# EAGLE design ext64K (EAGLE 9.6.2)
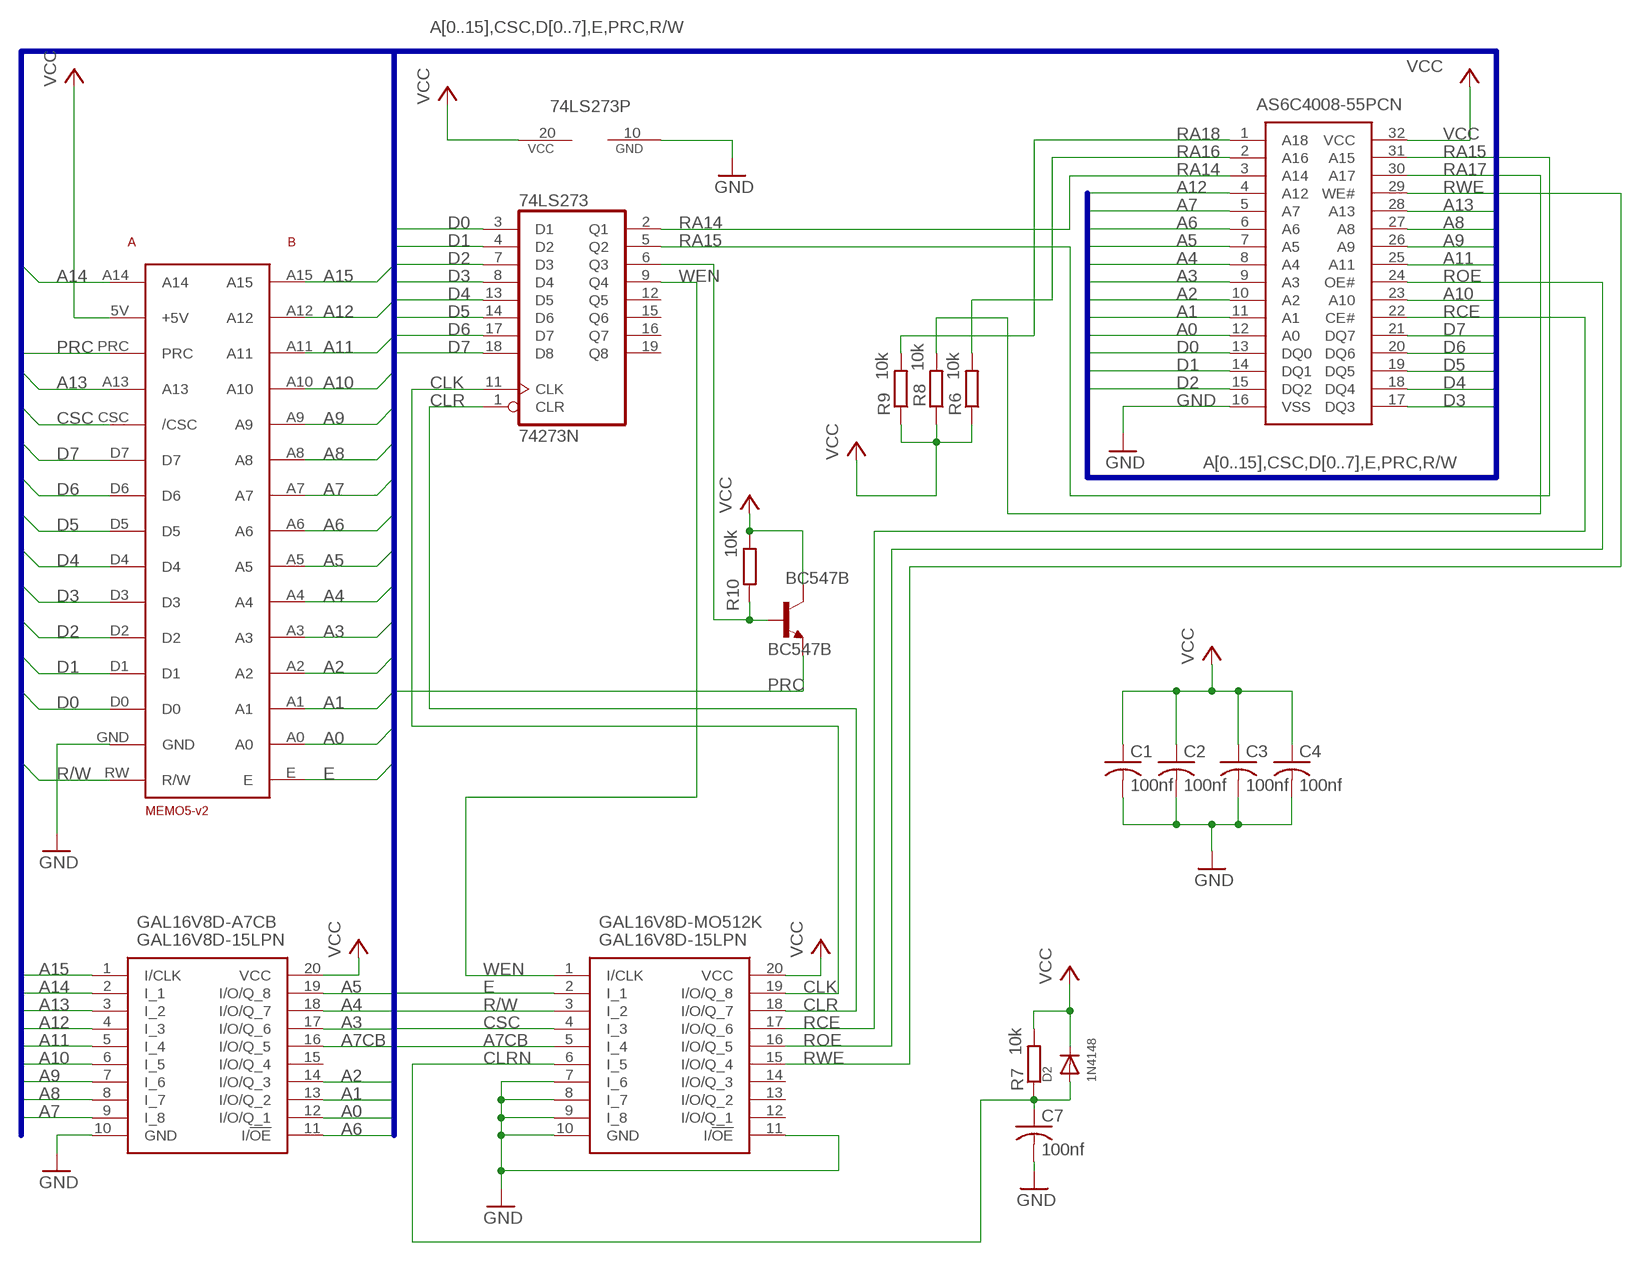
[diagram p0: schematic, sheet 1]

## Parts
74LS273  74273N  [DIL20]
AS6C4008-55PCN  AS6C4008-55PCN  [DIP1524W58P254L4191H406Q32N]
BC547B  BC547B  [TO92]
C1  100nf  C-USC1206  [C1206]
C2  100nf  C-USC1206  [C1206]
C3  100nf  C-USC1206  [C1206]
C4  100nf  C-USC1206  [C1206]
C7  100nf  C-USC1206  [C1206]
D2  1N4148  DIODEDO-1N4148  [DO-1N4148]
GAL16V8D-A7CB  GAL16V8D-15LPN  [DIP762W56P254L2591H533Q20N]
GAL16V8D-MO512K  GAL16V8D-15LPN  [DIP762W56P254L2591H533Q20N]
R6  10k  R-EU_R1206  [R1206]
R7  10k  R-EU_R1206  [R1206]
R8  10k  R-EU_R1206  [R1206]
R9  10k  R-EU_R1206  [R1206]
R10  10k  R-EU_R1206  [R1206]
U$1  MEMO5-V2BRD  [MEMO5-BOARD]

## Nets
A0: AS6C4008-55PCN.12(A0) GAL16V8D-A7CB.12(I/O/Q_1) U$1.A0
A1: AS6C4008-55PCN.11(A1) GAL16V8D-A7CB.13(I/O/Q_2) U$1.A1
A2: AS6C4008-55PCN.10(A2) GAL16V8D-A7CB.14(I/O/Q_3) U$1.A2
A3: AS6C4008-55PCN.9(A3) GAL16V8D-A7CB.17(I/O/Q_6) U$1.A3
A4: AS6C4008-55PCN.8(A4) GAL16V8D-A7CB.18(I/O/Q_7) U$1.A4
A5: AS6C4008-55PCN.7(A5) GAL16V8D-A7CB.19(I/O/Q_8) U$1.A5
A6: AS6C4008-55PCN.6(A6) GAL16V8D-A7CB.11(I/!OE) U$1.A6
A7: AS6C4008-55PCN.5(A7) GAL16V8D-A7CB.9(I_8) U$1.A7
A7CB: GAL16V8D-A7CB.16(I/O/Q_5) GAL16V8D-MO512K.5(I_4)
A8: AS6C4008-55PCN.27(A8) GAL16V8D-A7CB.8(I_7) U$1.A8
A9: AS6C4008-55PCN.26(A9) GAL16V8D-A7CB.7(I_6) U$1.A9
A10: AS6C4008-55PCN.23(A10) GAL16V8D-A7CB.6(I_5) U$1.A10
A11: AS6C4008-55PCN.25(A11) GAL16V8D-A7CB.5(I_4) U$1.A11
A12: AS6C4008-55PCN.4(A12) GAL16V8D-A7CB.4(I_3) U$1.A12
A13: AS6C4008-55PCN.28(A13) GAL16V8D-A7CB.3(I_2) U$1.A13
A14: GAL16V8D-A7CB.2(I_1) U$1.A14
A15: GAL16V8D-A7CB.1(I/CLK) U$1.A15
CLK: 74LS273.11(CLK) GAL16V8D-MO512K.19(I/O/Q_8)
CLR: 74LS273.1(CLR) GAL16V8D-MO512K.18(I/O/Q_7)
CLRN: C7.1 D2.A GAL16V8D-MO512K.6(I_5) R7.1
CSC: GAL16V8D-MO512K.4(I_3) U$1.CSC(/CSC)
D0: 74LS273.3(D1) AS6C4008-55PCN.13(DQ0) U$1.D0
D1: 74LS273.4(D2) AS6C4008-55PCN.14(DQ1) U$1.D1
D2: 74LS273.7(D3) AS6C4008-55PCN.15(DQ2) U$1.D2
D3: 74LS273.8(D4) AS6C4008-55PCN.17(DQ3) U$1.D3
D4: 74LS273.13(D5) AS6C4008-55PCN.18(DQ4) U$1.D4
D5: 74LS273.14(D6) AS6C4008-55PCN.19(DQ5) U$1.D5
D6: 74LS273.17(D7) AS6C4008-55PCN.20(DQ6) U$1.D6
D7: 74LS273.18(D8) AS6C4008-55PCN.21(DQ7) U$1.D7
E: GAL16V8D-MO512K.2(I_1) U$1.E
GND [pwr]: 74LS273.10(GND) AS6C4008-55PCN.16(VSS) C1.2 C2.2 C3.2 C4.2 C7.2 GAL16V8D-A7CB.10(GND) GAL16V8D-MO512K.7(I_6) GAL16V8D-MO512K.8(I_7) GAL16V8D-MO512K.9(I_8) GAL16V8D-MO512K.10(GND) GAL16V8D-MO512K.11(I/!OE) U$1.GND
N$1: 74LS273.6(Q3) BC547B.2(B) R10.1
PRC: BC547B.1(E) U$1.PRC
R/W: GAL16V8D-MO512K.3(I_2) U$1.RW(R/W)
RA14: 74LS273.2(Q1) AS6C4008-55PCN.3(A14)
RA15: 74LS273.5(Q2) AS6C4008-55PCN.31(A15)
RA16: AS6C4008-55PCN.2(A16) R6.2
RA17: AS6C4008-55PCN.30(A17) R8.2
RA18: AS6C4008-55PCN.1(A18) R9.2
RCE: AS6C4008-55PCN.22(CE#) GAL16V8D-MO512K.17(I/O/Q_6)
ROE: AS6C4008-55PCN.24(OE#) GAL16V8D-MO512K.16(I/O/Q_5)
RWE: AS6C4008-55PCN.29(WE#) GAL16V8D-MO512K.15(I/O/Q_4)
VCC [pwr]: 74LS273.20(VCC) AS6C4008-55PCN.32(VCC) BC547B.3(C) C1.1 C2.1 C3.1 C4.1 D2.C GAL16V8D-A7CB.20(VCC) GAL16V8D-MO512K.20(VCC) R6.1 R7.2 R8.1 R9.1 R10.2 U$1.5V(+5V)
WEN: 74LS273.9(Q4) GAL16V8D-MO512K.1(I/CLK)
Unconnected: 74LS273.12(Q5) 74LS273.15(Q6) 74LS273.16(Q7) 74LS273.19(Q8) GAL16V8D-A7CB.15(I/O/Q_4) GAL16V8D-MO512K.12(I/O/Q_1) GAL16V8D-MO512K.13(I/O/Q_2) GAL16V8D-MO512K.14(I/O/Q_3)

## Buses
A[0..15],CSC,D[0..7],E,PRC,R/W

## Library data of the parts
74LS273 = 74xx-us:74*273: Octal D type FLIP FLOP, clear
AS6C4008-55PCN = SamacSys_Parts:AS6C4008-55PCN: CMOS SRAM Source: Datasheet <http://componentsearchengine.com/Datasheets/1/AS6C4008-55PCN.pdf>; DESCRIPTION: CMOS SRAM; HEIGHT: 4.064mm; MANUFACTURER_NAME: Alliance Memory; MANUFACTURER_PART_NUMBER: AS6C4008-55PCN; MOUSER_PART_NUMBER: 913-AS6C4008-55PCN; MOUSER_PRICE-STOCK: https://www.mouser.co.uk/ProductDetail/Alliance-Memory/AS6C4008-55PCN?qs=E5c5%252Bmu3i3%252BMOyro1Tlhzg%3D%3D
BC547B = transistor-npn:BC547*: NPN Transistor
C1-C4 C7 = resistor:C-US: CAPACITOR, American symbol
D2 = adafruit:DIODE: Diode SMADIODE - SMA Surface Mount Package 20V 1A Schottky Diode Digikey: 641-1014-6-ND DO-1N4148 - Through Hole Small Current Diode SOD-123 20V 1 A (.5mV Vf) Schottky Diode - Digikey: MBRX120TPMSCT-ND SOD-323 10V 570mA (.38mV Vf, 3ns) Schottky Diode - Digikey: ZLLS410CT-ND SOD-523 30V 30mA Schottky Diode (RB751S-40TE61) - Digikey: RB751S-40TE61CT-ND SOT23-R/W - SOT23 Package (R = Solder Paste/Reflow Ovens, W = Hand-Soldering) BAT54Film 40V 300mA - Digikey: 497-7162-1-ND
GAL16V8D-A7CB GAL16V8D-MO512K = SamacSys_Parts:GAL16V8D-15LPN: IC CPLD 8MC 15NS 20DIP Source: Datasheet <http://uk.rs-online.com/web/p/products/6250071>; DESCRIPTION: IC CPLD 8MC 15NS 20DIP; HEIGHT: 5.334mm; MANUFACTURER_NAME: Lattice Semiconductor; MANUFACTURER_PART_NUMBER: GAL16V8D-15LPN; MOUSER_PART_NUMBER: 842-GAL16V8D15LPN; MOUSER_PRICE-STOCK: https://www.mouser.co.uk/ProductDetail/Lattice/GAL16V8D-15LPN/?qs=SKRcP3y%252BHgMoZwlrwJ0h8g%3D%3D
R6-R10 = resistor:R-EU_: RESISTOR, European symbol
U$1 = custom-chips:MEMO5-V2

## Net classes
0 default: width 0.152 mm, drill 0.152 mm, clearance 0.152 mm
1 pwr: width 0.305 mm, drill 0.305 mm, clearance 0.305 mm

## Board
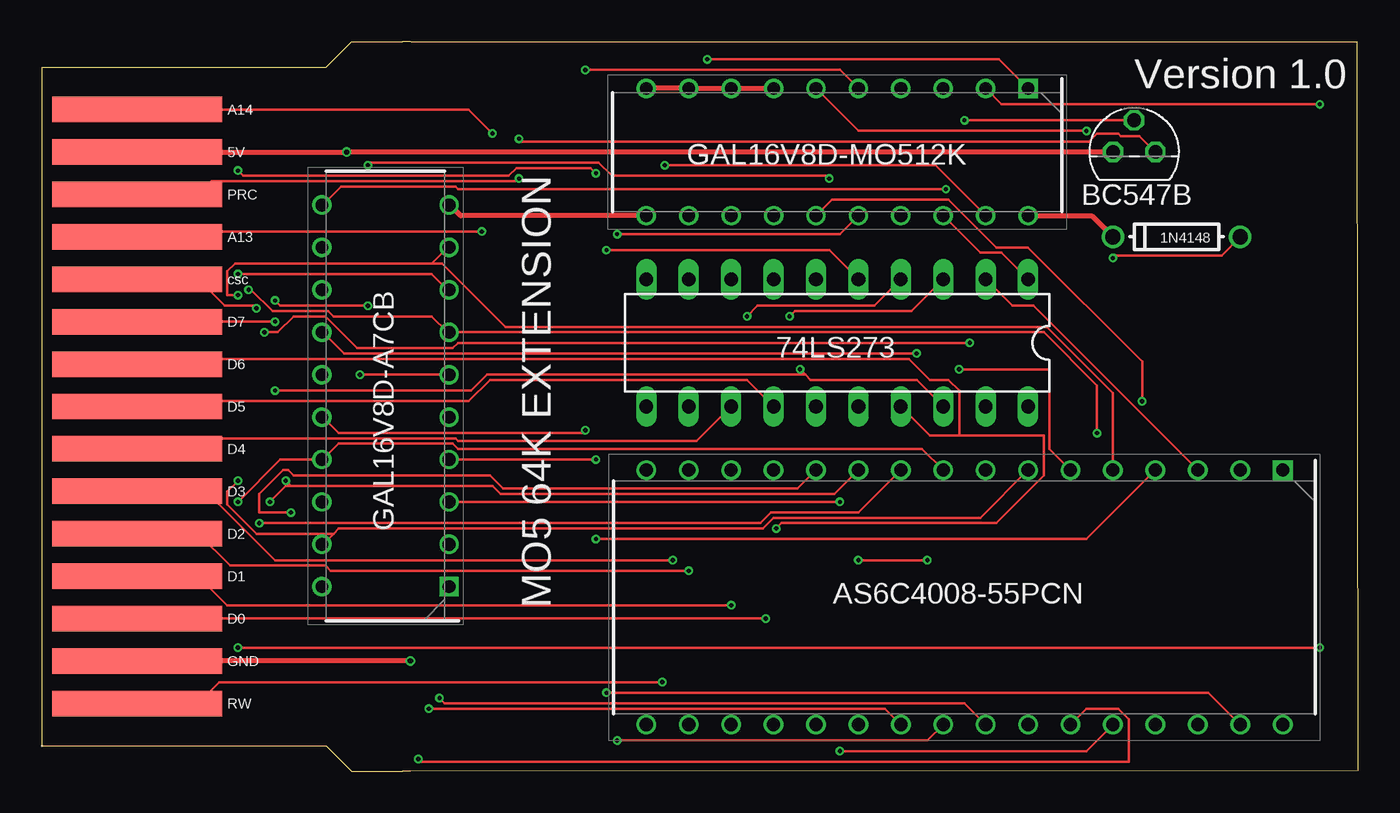
[diagram p1: board, top side]
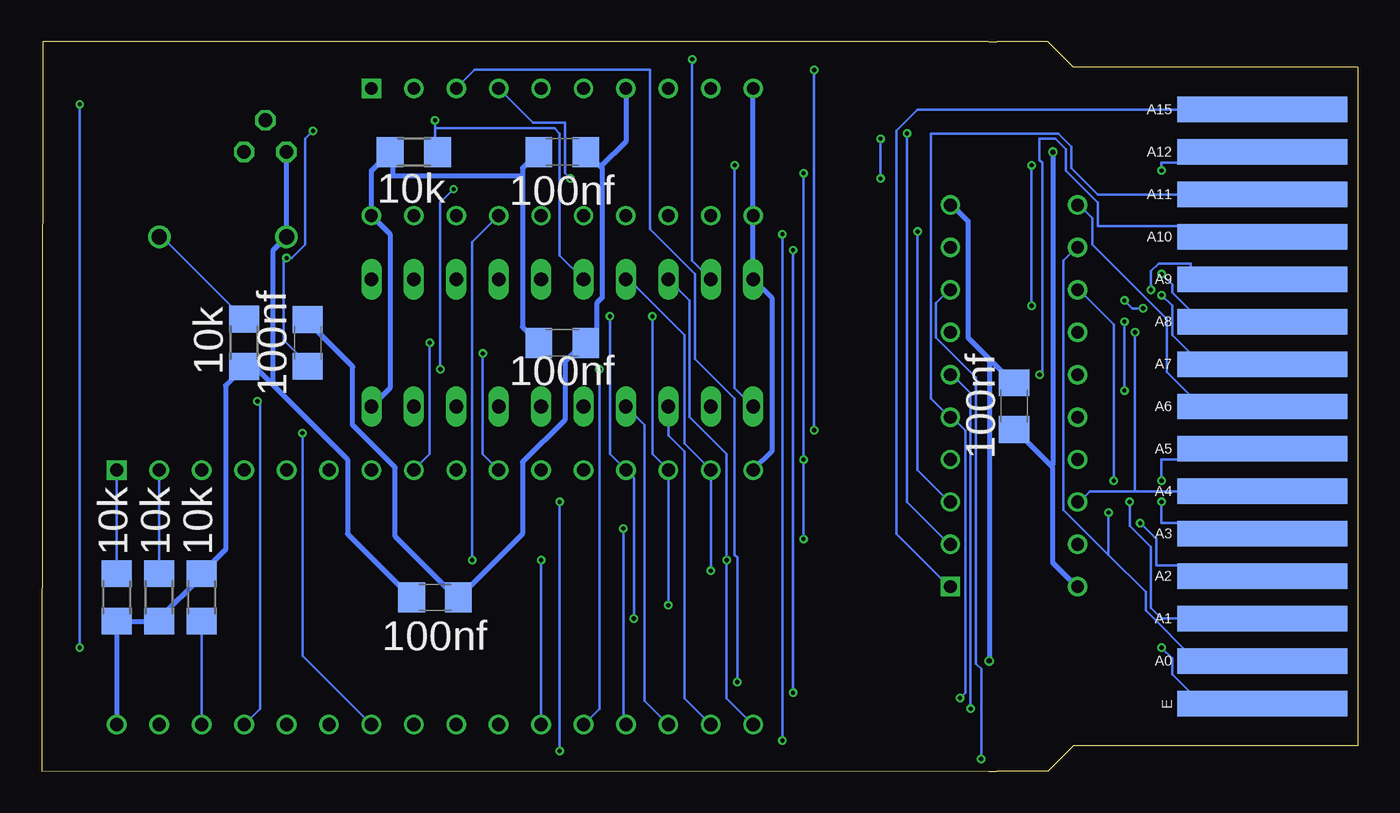
[diagram p2: board, bottom side, seen from below]

Size 78.79 x 43.69 mm. Coordinates in mm from the lower left corner, seen from the top.
Outline: 22.12,43.69 78.74,43.69 78.79,0.03 22.1,0 21.59,0
Outline: 22.1,43.69 21.59,43.69
Copper layers (1*16): Top 0.035559375mm / dielectric 1.6mm / Bottom 0.035559375mm
Design rules "oshpark-2layer": minimum track width 6mil, minimum drill 10mil, track to track 6mil, track to pad 6mil, pad to pad 6mil, via to via 6mil, smd to smd 6mil, copper to edge 15mil, drill to drill 6mil, minimum pad ring 5mil, minimum via ring 5mil, stop-mask expansion 2.5mil, vias tented up to drill 0mil, thermal gap 10mil
vRestrict: area 9.5,1.5 to 11.4,42.2; area 15.2,9.8 to 18.4,35.2; area 22.9,9.8 to 26,35.2; area 34.9,39.6 to 60.3,42.2; area 35.6,32 to 60.3,34.5; area 34.9,27.6 to 60.3,31.4; area 34.9,19.9 to 60.3,23.7; area 34.9,16.8 to 75.6,19.9; area 34.9,1.5 to 75.6,4.1; area 67.3,6.6 to 76.2,13.6; area 52.1,8.5 to 58.4,12.3; area 61.6,22.5 to 68.6,28.8; area 68.6,21.2 to 74.9,30.1; area 62.9,35.2 to 67.9,40.9

### Footprints (pad centres in the part's own frame; a part is rotated, then mirrored left to right if it is on the bottom)
DIL20 = drill 0.813 long: 1 -11.43,-3.81; 2 -8.89,-3.81; 3 -6.35,-3.81; 4 -3.81,-3.81; 5 -1.27,-3.81; 6 1.27,-3.81; 7 3.81,-3.81; 8 6.35,-3.81; 9 8.89,-3.81; 10 11.43,-3.81; 11 11.43,3.81; 12 8.89,3.81; 13 6.35,3.81; 14 3.81,3.81; 15 1.27,3.81; 16 -1.27,3.81; 17 -3.81,3.81; 18 -6.35,3.81; 19 -8.89,3.81; 20 -11.43,3.81
DIP1524W58P254L4191H406Q32N = drill 0.784 pad 1.184 square: 1 -7.62,19.05 | drill 0.784 pad 1.184: 2 -7.62,16.51; 3 -7.62,13.97; 4 -7.62,11.43; 5 -7.62,8.89; 6 -7.62,6.35; 7 -7.62,3.81; 8 -7.62,1.27; 9 -7.62,-1.27; 10 -7.62,-3.81; 11 -7.62,-6.35; 12 -7.62,-8.89; 13 -7.62,-11.43; 14 -7.62,-13.97; 15 -7.62,-16.51; 16 -7.62,-19.05; 17 7.62,-19.05; 18 7.62,-16.51; 19 7.62,-13.97; 20 7.62,-11.43; 21 7.62,-8.89; 22 7.62,-6.35; 23 7.62,-3.81; 24 7.62,-1.27; 25 7.62,1.27; 26 7.62,3.81; 27 7.62,6.35; 28 7.62,8.89; 29 7.62,11.43; 30 7.62,13.97; 31 7.62,16.51; 32 7.62,19.05
TO92 = drill 0.813 octagon: 1 1.27,0; 2 0,1.905; 3 -1.27,0
C1206 = smd 1.6 x 1.8: 1 -1.4,0; 2 1.4,0
DO-1N4148 = drill 0.9: A -3.81,0; C 3.81,0
DIP762W56P254L2591H533Q20N = drill 0.759 pad 1.159 square: 1 -3.81,11.43 | drill 0.759 pad 1.159: 2 -3.81,8.89; 3 -3.81,6.35; 4 -3.81,3.81; 5 -3.81,1.27; 6 -3.81,-1.27; 7 -3.81,-3.81; 8 -3.81,-6.35; 9 -3.81,-8.89; 10 -3.81,-11.43; 11 3.81,-11.43; 12 3.81,-8.89; 13 3.81,-6.35; 14 3.81,-3.81; 15 3.81,-1.27; 16 3.81,1.27; 17 3.81,3.81; 18 3.81,6.35; 19 3.81,8.89; 20 3.81,11.43
R1206 = smd 1.6 x 1.803: 1 -1.422,0; 2 1.422,0
MEMO5-BOARD = smd 1.524 x 10.16: 5V -12.7,5.715; A13 -7.62,5.715; A14 -15.24,5.715; CSC -5.08,5.715; D0 15.24,5.715; D1 12.7,5.715; D2 10.16,5.715; D3 7.62,5.715; D4 5.08,5.715; D5 2.54,5.715; D6 0,5.715; D7 -2.54,5.715; GND 17.78,5.715; PRC -10.16,5.715; RW 20.32,5.715 | smd 1.524 x 10.16 bottom: A0 17.78,5.715; A1 15.24,5.715; A2 12.7,5.715; A3 10.16,5.715; A4 7.62,5.715; A5 5.08,5.715; A6 2.54,5.715; A7 0,5.715; A8 -2.54,5.715; A9 -5.08,5.715; A10 -7.62,5.715; A11 -10.16,5.715; A12 -12.7,5.715; A15 -15.24,5.715; E 20.32,5.715

### Placement (x,y rotation side)
74LS273  47.62,25.65 180 top
AS6C4008-55PCN  55.24,10.41 270 top
BC547B  65.41,37.08 0 top
C1  47.62,37.08 0 bottom
C2  55.24,10.41 0 bottom
C3  20.57,21.87 90 bottom
C4  47.62,25.65 0 bottom
C7  62.87,25.65 90 bottom
D2  67.94,32 180 top
GAL16V8D-A7CB  20.57,22.48 180 top
GAL16V8D-MO512K  47.62,37.08 270 top
R6  71.75,10.41 90 bottom
R7  66.67,25.65 270 bottom
R8  69.22,10.41 270 bottom
R9  74.3,10.41 90 bottom
R10  56.52,37.08 180 bottom
U$1  0,24.38 270 top

### Tracks (layer width: path | path; a pad name or v marks a point on that pad's centre or on a via)
A0  (via drill 0.25)
  Top 0.152: AS6C4008-55PCN.12 45.24,16.92 27.62,16.92 26.83,17.72 15.08,17.72 14.76,18.03 14.45,18.03 13.02,16.61 13.02,15.49 v14.92,15.49
  Bottom 0.152: 14.92,12.95 12.7,10.73 12.7,9.62 9.68,6.6 U$1.A0 | 14.92,12.95 17.62,15.65 17.62,30.58 16.83,31.37 GAL16V8D-A7CB.12 | 14.92,12.95 v14.92,15.49
A1  (via drill 0.25)
  Top 0.152: 14.92,17.08 v14.61,17.4 | 14.92,17.08 26.99,17.08 27.46,16.61 47.47,16.61 AS6C4008-55PCN.11 | v13.65,16.13 14.61,17.08 14.92,17.08
  Bottom 0.152: v14.61,17.4 14.61,26.77 16.67,28.83 GAL16V8D-A7CB.13 | U$1.A1 11.75,9.14 12.38,9.78 12.38,13.43 13.65,14.7 v13.65,16.13
A2  (via drill 0.25)
  Top 0.152: v52.39,25.02 18.1,25.02 16.83,26.29 GAL16V8D-A7CB.14 | v13.02,14.86 43.02,14.86 43.66,15.49 48.9,15.49 AS6C4008-55PCN.10
  Bottom 0.152: v52.39,25.02 52.39,18.99 AS6C4008-55PCN.10 | U$1.A2 6.35,12.32 12.06,12.32 12.06,13.91 v13.02,14.86
A3  (via drill 0.25)
  Top 0.152: AS6C4008-55PCN.9 52.7,19.3 24.92,19.3 24.61,19.62 17.78,19.62 16.83,18.67 GAL16V8D-A7CB.17 14.29,18.67 v11.75,16.13
  Bottom 0.152: U$1.A3 6.35,14.86 11.75,14.86 v11.75,16.13
A4  (via drill 0.25)
  Top 0.152: v55.56,25.65 24.92,25.65 24.61,25.34 18.89,25.34 16.99,27.24 15.08,27.24 14.13,26.29 v13.34,26.29
  Bottom 0.152: U$1.A4 13.34,16.76 | 13.34,16.76 16.03,16.76 16.67,16.13 GAL16V8D-A7CB.18 | AS6C4008-55PCN.8 55.56,18.99 v55.56,25.65 | 13.34,16.76 v13.34,26.29
A5  (via drill 0.25)
  Top 0.152: 17.46,14.22 17.78,14.54 43.18,14.54 43.81,15.18 56.2,15.18 AS6C4008-55PCN.7 | 17.46,14.22 16.83,13.59 GAL16V8D-A7CB.19 | v11.75,17.4 11.11,16.76 11.11,15.97 12.86,14.22 17.46,14.22
  Bottom 0.152: U$1.A5 6.35,18.67 11.75,18.67 v11.75,17.4
A6  (via drill 0.25)
  Top 0.152: AS6C4008-55PCN.6 60.33,19.3 60.33,24.07 v54.93,24.07 | v54.13,34.86 24.92,34.86 24.77,35.02 17.94,35.02 16.83,33.91 GAL16V8D-A7CB.11
  Bottom 0.152: U$1.A6 9.37,21.84 11.43,23.91 11.43,27.08 15.88,31.53 15.88,33.12 16.67,33.91 GAL16V8D-A7CB.11 | v54.93,24.07 54.93,34.07 v54.13,34.86
A7  (via drill 0.25)
  Top 0.152: 23.34,30.42 24.29,31.37 GAL16V8D-A7CB.9 | 23.34,30.42 11.59,30.42 11.11,29.94 11.11,28.51 v11.75,28.51 | AS6C4008-55PCN.5 64.14,22.64 60.17,26.61 27.78,26.61 23.97,30.42 23.34,30.42
  Bottom 0.152: v11.75,28.51 11.11,27.88 11.11,26.13 9.37,24.38 U$1.A7
A7CB  (via drill 0.25)
  Top 0.152: v32.54,20.42 32.38,20.26 17.78,20.26 16.83,21.21 GAL16V8D-A7CB.16 | v32.54,42.01 47.78,42.01 GAL16V8D-MO512K.5
  Bottom 0.152: v32.54,42.01 v32.54,20.42
A8  (via drill 0.25)
  Top 0.152: v11.75,29.78 23.34,29.78 24.29,28.83 GAL16V8D-A7CB.8 | AS6C4008-55PCN.27 62.55,3.75 64.45,3.75 65.09,3.11 65.09,0.57 22.7,0.57 v22.54,0.73
  Bottom 0.152: v11.75,29.78 11.11,29.15 11.11,28.67 9.37,26.92 U$1.A8 | v22.54,0.73 22.54,6.13 22.86,6.45 22.86,23.59 25.24,25.97 25.24,28.04 24.45,28.83 GAL16V8D-A7CB.8
A9  (via drill 0.25)
  Top 0.152: v12.38,28.83 12.54,28.83 13.81,27.56 17.14,27.56 17.46,27.24 23.34,27.24 24.29,26.29 GAL16V8D-A7CB.7 60.01,26.29 63.18,23.11 v63.18,20.26
  Bottom 0.152: v12.38,28.83 12.38,29.94 11.91,30.42 10,30.42 10,30.1 9.37,29.46 U$1.A9 | AS6C4008-55PCN.26 63.18,6.92 v63.18,20.26
A10  (via drill 0.25)
  Top 0.152: v23.18,3.75 50.48,3.75 AS6C4008-55PCN.23 | GAL16V8D-A7CB.6 v19.05,23.75
  Bottom 0.152: v23.18,3.75 23.18,22.64 24.29,23.75 GAL16V8D-A7CB.6 | U$1.A10 6.35,32.64 15.56,32.64 15.56,34.07 17.46,35.97 17.46,37.24 18.1,37.88 19.05,37.88 19.05,36.61 18.89,36.45 18.89,23.91 v19.05,23.75
A11  (via drill 0.25)
  Top 0.152: v23.81,4.38 24.13,4.06 55.24,4.06 AS6C4008-55PCN.25
  Bottom 0.152: v23.81,4.38 23.5,4.7 23.5,20.42 24.29,21.21 GAL16V8D-A7CB.5 24.45,21.21 25.56,22.32 25.56,38.2 17.94,38.2 17.14,37.4 17.14,36.13 15.56,34.54 U$1.A11
A12  (via drill 0.25)
  Top 0.152: v33.18,18.67 GAL16V8D-A7CB.4 | v33.18,13.91 62.55,13.91 AS6C4008-55PCN.4 | v11.75,35.97 12.06,35.66 27.94,35.66 28.42,36.13 32.86,36.13 v33.18,35.81
  Bottom 0.152: v33.18,13.91 v33.18,18.67 v33.18,35.81 | U$1.A12 6.35,36.45 11.75,36.45 v11.75,35.97
A13  (via drill 0.25)
  Top 0.152: v26.35,32.32 6.03,32.32 U$1.A13 | AS6C4008-55PCN.28 62.55,1.21 v47.78,1.21 | GAL16V8D-A7CB.3 v47.78,16.13
  Bottom 0.152: v26.35,32.32 26.35,18.03 24.45,16.13 GAL16V8D-A7CB.3 | v47.78,16.13 v47.78,1.21
A14  (via drill 0.25)
  Top 0.152: v26.99,38.2 25.56,39.62 U$1.A14
  Bottom 0.152: v26.99,38.2 26.99,16.13 24.45,13.59 GAL16V8D-A7CB.2
A15
  Bottom 0.152: U$1.A15 26.35,39.62 27.62,38.35 27.62,14.22 24.45,11.05 GAL16V8D-A7CB.1
CLK  (via drill 0.25)
  Top 0.152: GAL16V8D-MO512K.19 53.5,36.29 v37.31,36.29
  Bottom 0.152: v37.31,36.29 37.31,22.96 74LS273.11
CLR
  Top 0.152: GAL16V8D-MO512K.18 56.2,31.05 57.47,31.05 74LS273.1
CLRN  (via drill 0.25)
  Top 0.152: v64.14,30.73 64.29,30.89 70.64,30.89 D2.A | GAL16V8D-MO512K.6 48.9,38.35 v62.55,38.35
  Bottom 0.152: C7.1 62.87,24.38 64.29,25.81 64.29,30.58 v64.14,30.73 63.82,30.73 63.02,31.53 63.02,37.88 v62.55,38.35 | D2.A 71.6,32 R7.1
CSC  (via drill 0.25)
  Top 0.152: v47.15,35.5 46.99,35.66 34.13,35.66 33.34,36.45 19.68,36.45 v19.53,36.29 | v19.53,27.88 14.29,27.88 v13.97,28.19 | v12.86,27.72 12.7,27.88 10.95,27.88 9.37,29.46 U$1.CSC
  Bottom 0.152: GAL16V8D-MO512K.4 49.37,38.83 47.47,38.83 47.47,35.81 v47.15,35.5 | v19.53,27.88 v19.53,36.29 | v13.97,28.19 13.49,27.72 v12.86,27.72
D0  (via drill 0.25)
  Top 0.152: v44.77,27.24 45.09,27.56 52.07,27.56 74LS273.3 | U$1.D0 v43.34,9.14
  Bottom 0.152: v44.77,27.24 44.77,18.99 AS6C4008-55PCN.13 43.34,17.56 v43.34,9.14
D1  (via drill 0.25)
  Top 0.152: v42.23,27.24 42.86,27.88 49.85,27.88 74LS273.4 | v41.27,9.94 11.11,9.94 9.37,11.68 U$1.D1
  Bottom 0.152: v42.23,27.24 42.23,18.99 AS6C4008-55PCN.14 v41.27,9.94
D2  (via drill 0.25)
  Top 0.152: v38.73,12 17.3,12 16.99,12.32 11.27,12.32 9.37,14.22 U$1.D2
  Bottom 0.152: 74LS273.7 43.66,29.46 40.32,26.13 40.32,19.62 AS6C4008-55PCN.15 v38.73,12
D3  (via drill 0.25)
  Top 0.152: U$1.D3 6.35,16.13 10.48,16.13 13.97,12.64 v37.78,12.64
  Bottom 0.152: AS6C4008-55PCN.17 37.78,4.38 v37.78,12.64 37.78,18.99 40.01,21.21 40.01,28.19 74LS273.8
D4
  Top 0.152: 74LS273.13 39.21,19.78 24.92,19.78 24.77,19.94 6.35,19.94 U$1.D4
  Bottom 0.152: AS6C4008-55PCN.18 40.32,4.38 40.32,19.15 41.27,20.1 74LS273.13
D5
  Top 0.152: 74LS273.14 42.23,23.43 26.83,23.43 25.56,22.16 6.03,22.16 U$1.D5
  Bottom 0.152: AS6C4008-55PCN.19 42.7,4.22 42.7,20.73 74LS273.14
D6  (via drill 0.25)
  Top 0.152: v43.97,14.54 44.29,14.86 57.15,14.86 60.01,17.72 60.01,20.1 54.93,20.1 | 54.93,20.1 53.18,20.1 74LS273.17 | U$1.D6 6.03,24.7 51.91,24.7 53.18,23.43 54.29,23.43 54.93,22.8 54.93,20.1
  Bottom 0.152: AS6C4008-55PCN.20 43.97,2.95 v43.97,14.54
D7  (via drill 0.25)
  Top 0.152: 45.72,23.75 46.04,23.43 52.39,23.43 74LS273.18 | 45.72,23.75 v45.4,24.07 | v13.97,26.92 U$1.D7 | v13.97,22.8 25.72,22.8 26.67,23.75 45.72,23.75
  Bottom 0.152: AS6C4008-55PCN.21 45.4,3.75 v45.4,24.07 | v13.97,22.8 v13.97,26.92
E  (via drill 0.25)
  Top 0.152: GAL16V8D-MO512K.2 57.47,39.94 v76.52,39.94 | v11.75,7.4 v76.52,7.4
  Bottom 0.152: v76.52,7.4 v76.52,39.94 | v11.75,7.4 11.11,6.76 11.11,5.81 9.37,4.06 U$1.E
GND  (via drill 0.3)
  Top 0.305: GAL16V8D-MO512K.10 GAL16V8D-MO512K.9 GAL16V8D-MO512K.8 GAL16V8D-MO512K.7 | GAL16V8D-MO512K.11 25.08,33.27 24.45,33.91 GAL16V8D-A7CB.10 | v22.07,6.6 U$1.GND
  Bottom 0.305: 45.32,36.21 46.2,37.08 C1.2 | 45.32,36.21 45.24,36.13 45.24,28.35 45.56,28.04 45.56,26.29 46.2,25.65 C4.2 46.35,25.65 47.47,24.54 47.47,21.05 50.01,18.51 50.01,14.22 53.82,10.41 C2.2 53.98,10.41 57.63,14.07 57.63,18.19 60.17,20.73 60.17,24.23 62.87,26.92 C7.2 | 21.99,24.62 23.34,25.97 23.34,32.96 24.29,33.91 GAL16V8D-A7CB.10 | 21.99,24.62 20.64,23.27 C3.2 | AS6C4008-55PCN.16 35.08,19.15 35.08,28.35 74LS273.10 GAL16V8D-MO512K.11 GAL16V8D-MO512K.10 | v22.07,6.6 22.07,24.54 21.99,24.62 | 45.32,36.21 43.81,37.72 GAL16V8D-MO512K.7
N$1  (via drill 0.25)
  Top 0.152: BC547B.2 v55.24,38.99
  Bottom 0.152: v55.24,38.99 55.24,38.51 | 55.24,38.51 55.24,37.08 R10.1 | 74LS273.6 47.78,30.89 47.78,38.2 48.1,38.51 55.24,38.51
PRC  (via drill 0.25)
  Top 0.152: BC547B.1 65.72,38.04 64.61,38.04 64.45,38.2 63.18,38.2 62.71,37.72 28.73,37.72 v28.57,37.88 | v28.57,35.5 28.42,35.34 10.16,35.34 9.37,34.54 U$1.PRC
  Bottom 0.152: v28.57,35.5 v28.57,37.88
R/W  (via drill 0.25)
  Top 0.152: v37.15,5.33 10.64,5.33 9.37,4.06 U$1.RW
  Bottom 0.152: GAL16V8D-MO512K.3 52.86,42.01 42.39,42.01 42.39,32.48 39.69,29.78 39.69,24.7 37.31,22.32 37.31,12.95 37.15,12.8 v37.15,5.33
RA14
  Top 0.152: AS6C4008-55PCN.3 59.37,27.88 58.1,27.88 74LS273.2
RA15  (via drill 0.25)
  Top 0.152: AS6C4008-55PCN.31 69.85,4.7 v33.81,4.7 | v33.81,31.21 47.15,31.21 74LS273.5
  Bottom 0.152: v33.81,31.21 v33.81,4.7
RA16
  Bottom 0.152: AS6C4008-55PCN.2 R6.2
RA17
  Bottom 0.152: AS6C4008-55PCN.30 R8.2
RA18
  Bottom 0.152: AS6C4008-55PCN.1 R9.2
RCE  (via drill 0.25)
  Top 0.152: v48.9,12.64 v53.02,12.64
  Bottom 0.152: GAL16V8D-MO512K.17 53.02,31.69 v53.02,12.64 | AS6C4008-55PCN.22 v48.9,12.64
ROE  (via drill 0.25)
  Top 0.152: GAL16V8D-MO512K.16 47.78,32.16 v34.45,32.16 | v34.45,1.84 53.02,1.84 AS6C4008-55PCN.24
  Bottom 0.152: v34.45,1.84 v34.45,32.16
RWE  (via drill 0.25)
  Top 0.152: GAL16V8D-MO512K.15 47.31,34.23 54.29,34.23 57.15,31.37 59.05,31.37 65.88,24.54 v65.88,22.16
  Bottom 0.152: v65.88,22.16 65.72,22 65.72,3.75 AS6C4008-55PCN.29
VCC  (via drill 0.3)
  Top 0.305: U$1.5V v18.26,37.08 BC547B.3 | D2.C 62.87,33.27 GAL16V8D-MO512K.20
  Bottom 0.305: 18.34,18.27 18.26,18.19 18.26,12.48 16.83,11.05 GAL16V8D-A7CB.20 | 18.34,18.27 20.48,20.42 C3.1 | v18.26,37.08 18.26,18.35 18.34,18.27 | 50.01,35.66 50.01,36.13 49.05,37.08 C1.1 | 50.01,35.66 50.01,26.61 49.05,25.65 C4.1 | BC547B.3 D2.C 64.93,31.21 64.93,23.27 65.01,23.19 | 74LS273.20 57.94,22.96 57.94,32.16 GAL16V8D-MO512K.20 59.05,35.97 R10.2 57.78,37.08 57.78,35.66 50.01,35.66 | R9.1 R6.1 71.75,9.14 69.22,11.68 R8.1 67.79,13.27 67.79,23.11 R7.2 | R9.1 AS6C4008-55PCN.32 | R9.1 | 65.01,23.19 66.04,24.23 R7.2 | 65.01,23.19 60.48,18.67 60.48,14.22 56.67,10.41 C2.1 | R7.2
WEN  (via drill 0.25)
  Top 0.152: GAL16V8D-MO512K.1 57.31,42.64 v39.85,42.64
  Bottom 0.152: v39.85,42.64 39.85,30.58 74LS273.9

### Text on the board
tPlace: Version 1.0 | MO5 64K EXTENSION
bPlace: 10k | 100nf | 100nf | 10k | 100nf | 100nf | 10k | 10k | 10k | 100nf